# Altium schematic sheet Christmas-2024_TSO-PCB_MASTER.SchDoc
size A; SheetNumber: 1; SheetTotal: 9
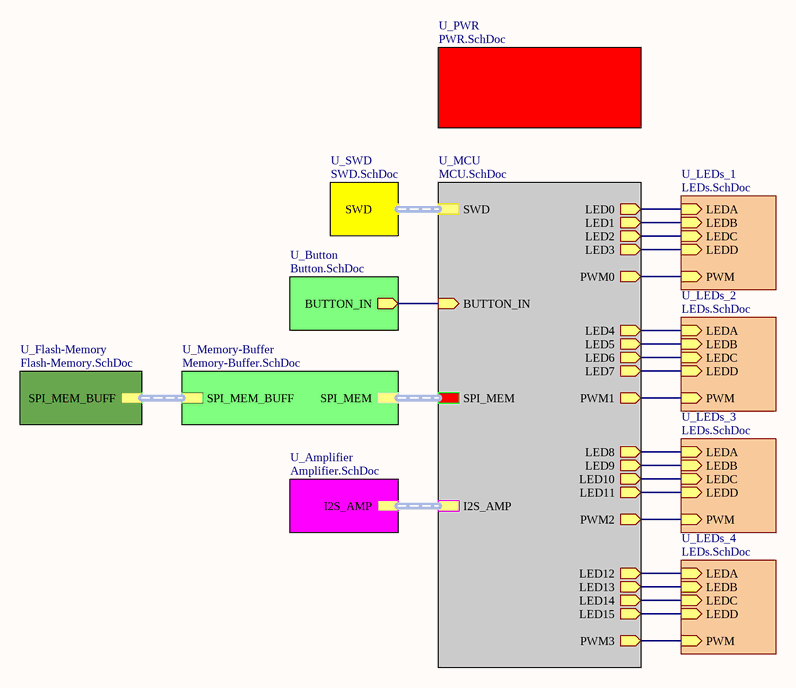
[diagram p0: Christmas-2024_TSO-PCB_MASTER.SchDoc]

## Sub-sheets
U_Amplifier = Amplifier.SchDoc: I2S_AMP (harness I2S_AMP)
U_Button = Button.SchDoc: BUTTON_IN (out)
U_Flash-Memory = Flash-Memory.SchDoc: SPI_MEM_BUFF (harness SPI_MEM_BUFF)
U_LEDs_1 = LEDs.SchDoc: PWM (in), LEDA (in), LEDB (in), LEDC (in), LEDD (in)
U_LEDs_2 = LEDs.SchDoc: PWM (in), LEDA (in), LEDB (in), LEDC (in), LEDD (in)
U_LEDs_3 = LEDs.SchDoc: PWM (in), LEDA (in), LEDB (in), LEDC (in), LEDD (in)
U_LEDs_4 = LEDs.SchDoc: PWM (in), LEDA (in), LEDB (in), LEDC (in), LEDD (in)
U_MCU = MCU.SchDoc: SPI_MEM (harness SPI_MEM), I2S_AMP (harness I2S_AMP), SWD (harness SWD), BUTTON_IN (in), PWM0 (out), PWM1 (out), PWM2 (out), PWM3 (out), LED0 (out), LED1 (out), LED2 (out), LED3 (out), LED4 (out), LED5 (out), LED6 (out), LED7 (out), LED8 (out), LED9 (out), LED10 (out), LED11 (out), LED12 (out), LED13 (out), LED14 (out), LED15 (out)
U_Memory-Buffer = Memory-Buffer.SchDoc: SPI_MEM (harness SPI_MEM), SPI_MEM_BUFF (harness SPI_MEM_BUFF)
U_PWR = PWR.SchDoc: no entries
U_SWD = SWD.SchDoc: SWD (harness SWD)

## Nets
(unnamed): sheet U_MCU/BUTTON_IN, sheet U_Button/BUTTON_IN
(unnamed): sheet U_MCU/PWM0, sheet U_LEDs_1/PWM
(unnamed): sheet U_MCU/PWM1, sheet U_LEDs_2/PWM
(unnamed): sheet U_MCU/PWM2, sheet U_LEDs_3/PWM
(unnamed): sheet U_MCU/PWM3, sheet U_LEDs_4/PWM
(unnamed): sheet U_MCU/LED0, sheet U_LEDs_1/LEDA
(unnamed): sheet U_MCU/LED1, sheet U_LEDs_1/LEDB
(unnamed): sheet U_MCU/LED2, sheet U_LEDs_1/LEDC
(unnamed): sheet U_MCU/LED3, sheet U_LEDs_1/LEDD
(unnamed): sheet U_MCU/LED4, sheet U_LEDs_2/LEDA
(unnamed): sheet U_MCU/LED5, sheet U_LEDs_2/LEDB
(unnamed): sheet U_MCU/LED6, sheet U_LEDs_2/LEDC
(unnamed): sheet U_MCU/LED7, sheet U_LEDs_2/LEDD
(unnamed): sheet U_MCU/LED8, sheet U_LEDs_3/LEDA
(unnamed): sheet U_MCU/LED9, sheet U_LEDs_3/LEDB
(unnamed): sheet U_MCU/LED10, sheet U_LEDs_3/LEDC
(unnamed): sheet U_MCU/LED11, sheet U_LEDs_3/LEDD
(unnamed): sheet U_MCU/LED12, sheet U_LEDs_4/LEDA
(unnamed): sheet U_MCU/LED13, sheet U_LEDs_4/LEDB
(unnamed): sheet U_MCU/LED14, sheet U_LEDs_4/LEDC
(unnamed): sheet U_MCU/LED15, sheet U_LEDs_4/LEDD

## Buses and harness runs
harness sheet U_Amplifier/I2S_AMP = sheet U_MCU/I2S_AMP
harness sheet U_Flash-Memory/SPI_MEM_BUFF = sheet U_Memory-Buffer/SPI_MEM_BUFF
harness sheet U_MCU/SPI_MEM = sheet U_Memory-Buffer/SPI_MEM
harness sheet U_MCU/SWD = sheet U_SWD/SWD